# Altium project PMPi-PCB.PrjPcb
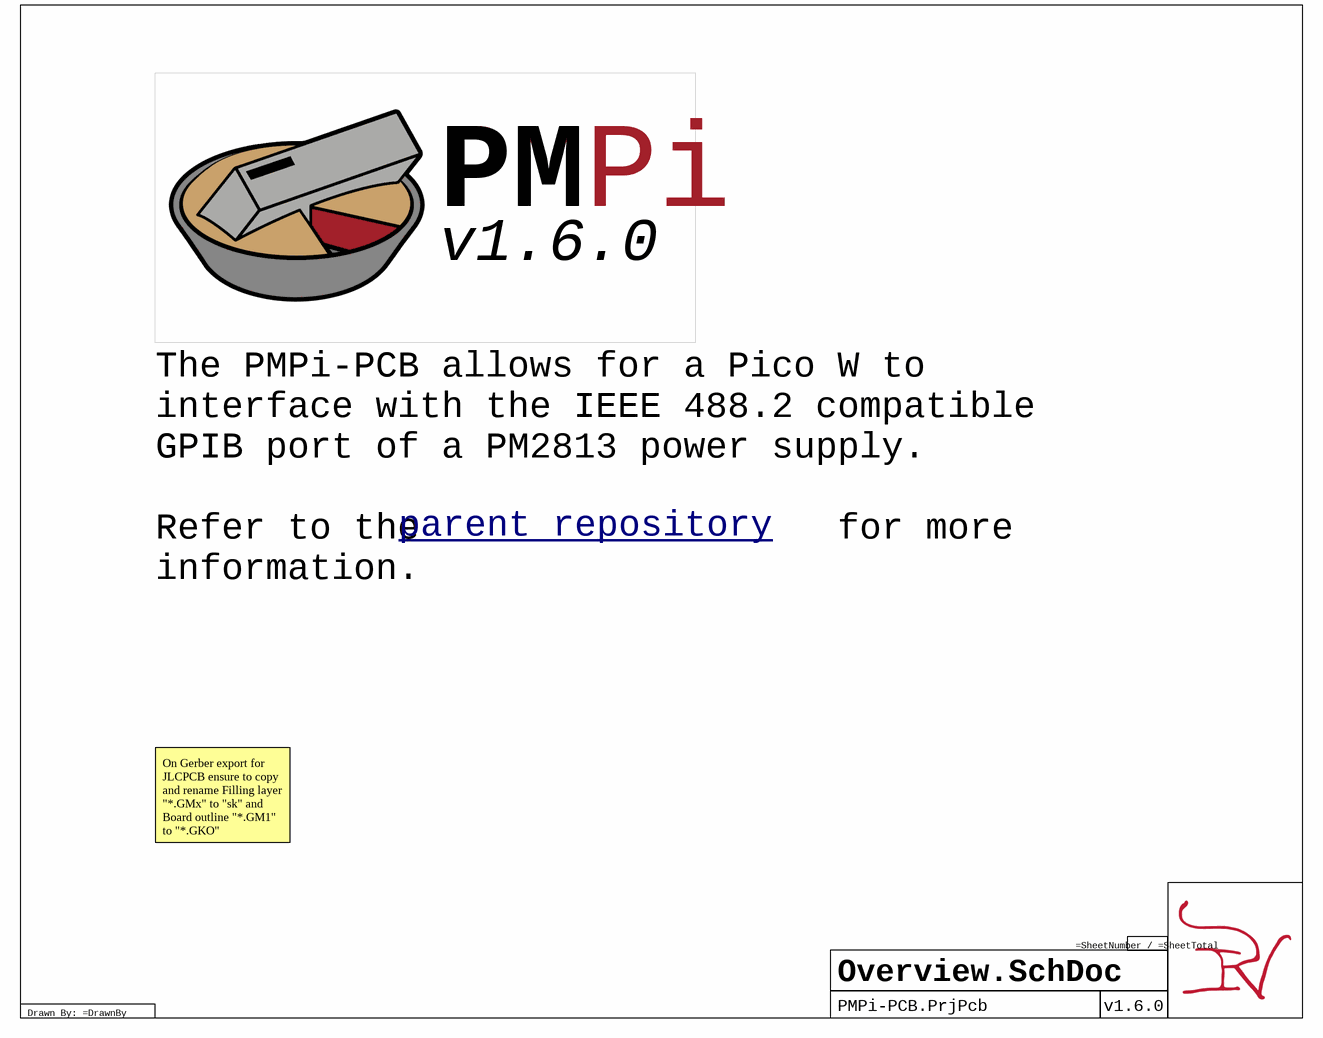
[diagram p0: Overview.SchDoc]
Version: v1.6.0; Revision: 1; Project: PMPi-PCB; LicenceYear: Copyright © 2024; Licence: Licenced under CERN-OHL-P v2; DrawnBy: IR; Author: IR
7 sheets, 31 parts. Net scope: hierarchical (ports join the sheet entries above them; power ports are global).
Board file: PMPi-PCB.PcbDoc
Sheets:
  Overview.SchDoc
    U_PMPi-PCB = PMPi-PCB.SchDoc
      U_GPIB = GPIB.SchDoc
      U_Pico = Pico.SchDoc
      U_EEPROM = Memory.SchDoc
      U_TempProbe = TempProbe.SchDoc
      U_Auth = Auth.SchDoc

## Sheet Overview.SchDoc: PMPi-PCB
size A; SheetNumber: 1; SheetTotal: 6

### Sub-sheets
U_PMPi-PCB = PMPi-PCB.SchDoc: no entries

### Notes on the sheet
- PMPi
- PM
- parent repository <https://github.com/LeHuman/PMPi>
- The PMPi-PCB allows for a Pico W to interface with the IEEE 488.2 compatible GPIB port of a PM2813 power supply.
  Refer to the                   for more information.
- On Gerber export for JLCPCB ensure to copy and rename Filling layer "*.GMx" to "sk" and Board outline "*.GM1" to "*.GKO"
- Drawn By: =DrawnBy

## Sheet PMPi-PCB.SchDoc
size A; SheetNumber: 2; SheetTotal: 7
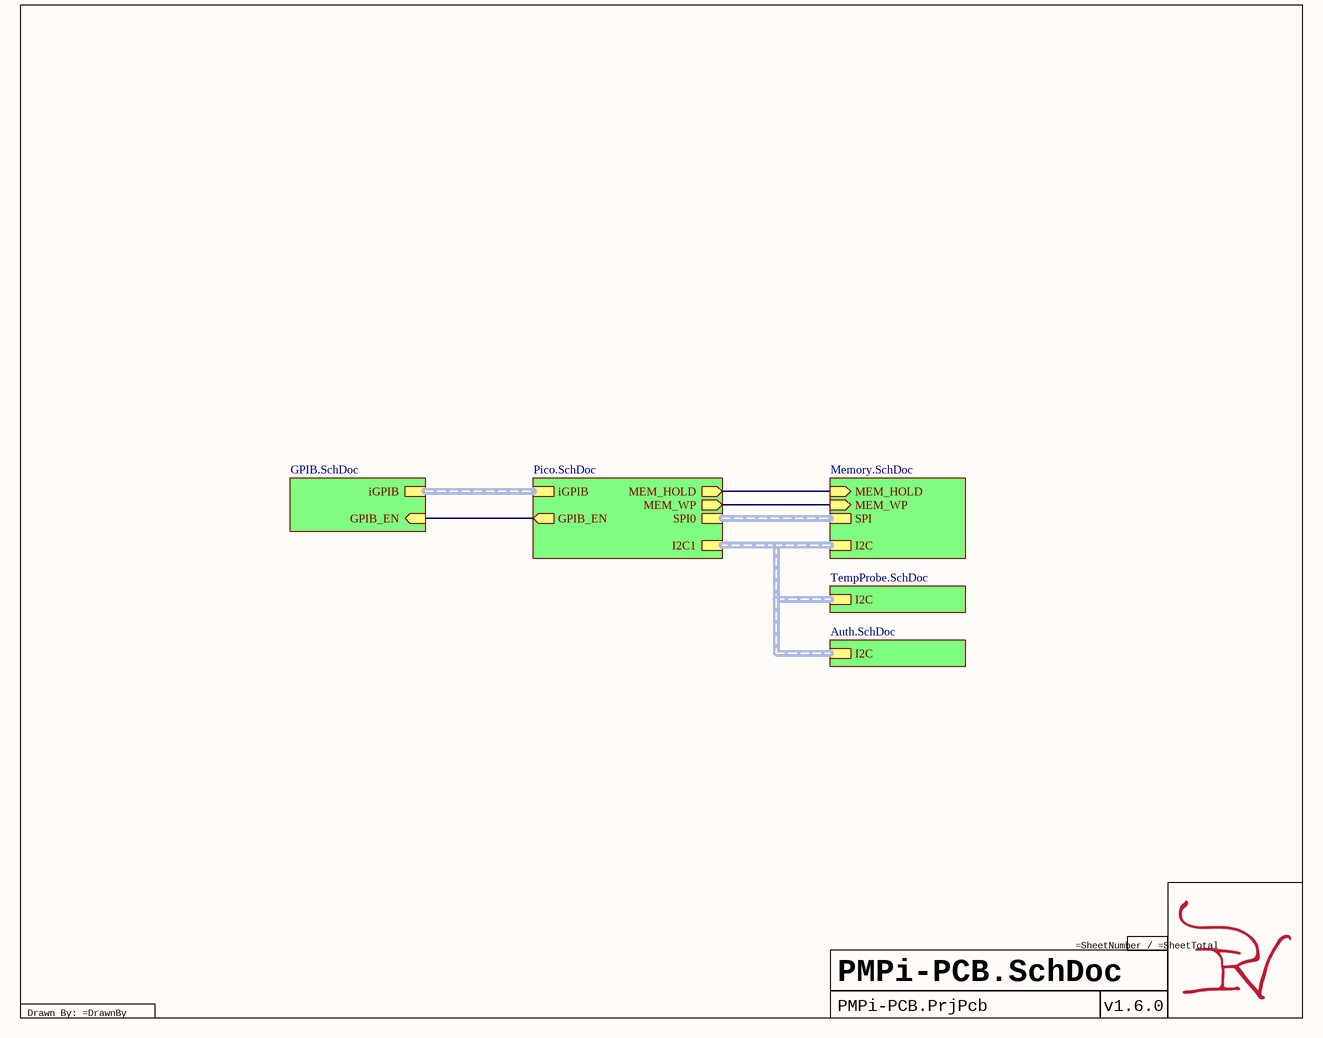
[diagram p1: PMPi-PCB.SchDoc]

### Sub-sheets
U_Auth = Auth.SchDoc: I2C (harness I2C)
U_EEPROM = Memory.SchDoc: MEM_HOLD (in), SPI (harness SPI), I2C (harness I2C), MEM_WP (in)
U_GPIB = GPIB.SchDoc: iGPIB (harness iGPIB), GPIB_EN (in)
U_Pico = Pico.SchDoc: iGPIB (harness iGPIB), SPI0 (harness SPI), MEM_HOLD (out), I2C1 (harness I2C), GPIB_EN (out), MEM_WP (out)
U_TempProbe = TempProbe.SchDoc: I2C (harness I2C)

### Nets
GPIB_EN: sheet U_GPIB/GPIB_EN, sheet U_Pico/GPIB_EN
HOLD: sheet U_Pico/MEM_HOLD, sheet U_EEPROM/MEM_HOLD
MEM_WP: sheet U_Pico/MEM_WP, sheet U_EEPROM/MEM_WP

### Buses and harness runs
harness sheet U_Auth/I2C = sheet U_EEPROM/I2C = sheet U_Pico/I2C1 = sheet U_TempProbe/I2C
harness sheet U_EEPROM/SPI = sheet U_Pico/SPI0
harness sheet U_GPIB/iGPIB = sheet U_Pico/iGPIB

### Notes on the sheet
- Drawn By: =DrawnBy

## Sheet GPIB.SchDoc
size A; SheetNumber: 3; SheetTotal: 6
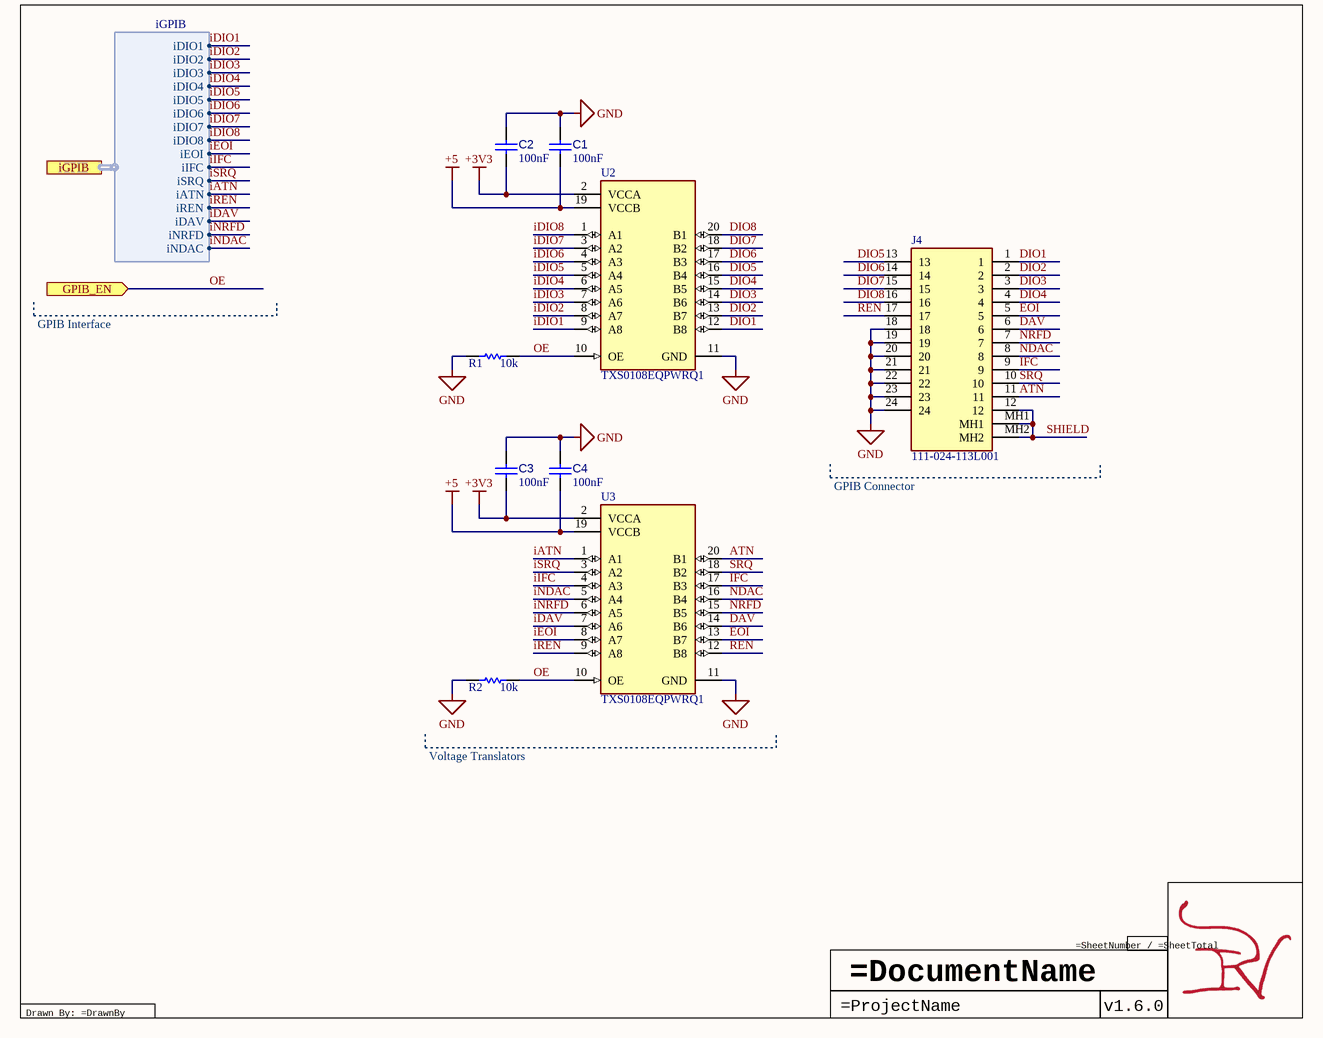
[diagram p2: GPIB.SchDoc]

### Parts
C1  value 100nF  [CAP 0402_1005]  (hidden comment: CAP-NP-2)
C2  value 100nF  [CAP 0402_1005]  (hidden comment: CAP-NP-2)
C3  value 100nF  [CAP 0402_1005]  (hidden comment: CAP-NP-2)
C4  value 100nF  [CAP 0402_1005]  (hidden comment: CAP-NP-2)
J4  111-024-113L001  [111024113L001]
R1  value 10k  [RES 0402_1005]  (hidden comment: 10K-0402-0.1/1)
R2  value 10k  [RES 0402_1005]  (hidden comment: 10K-0402-0.1/1)
U2  TXS0108EQPWRQ1  [FP-PW0020A-IPC_B]
U3  TXS0108EQPWRQ1  [FP-PW0020A-IPC_B]

### Ports
GPIB_EN (in), iGPIB (harness iGPIB)

### Harnesses
iGPIB: iEOI, iIFC, iSRQ, iATN, iREN, iDAV, iNRFD, iNDAC, iDIO8, iDIO7, iDIO6, iDIO5, iDIO4, iDIO3, iDIO2, iDIO1

### Nets
+3V3: C2.1 C3.1 U2.2(VCCA) U3.2(VCCA)
+5: C1.1 C4.1 U2.19(VCCB) U3.19(VCCB)
GND: C1.2 C2.2 C3.2 C4.2 J4.18 J4.19 J4.20 J4.21 J4.22 J4.23 J4.24 R1.1 R2.1 U2.11(GND) U3.11(GND)
ATN: J4.11 U3.20(B1)
DAV: J4.6 U3.14(B6)
DIO1: J4.1 U2.12(B8)
DIO2: J4.2 U2.13(B7)
DIO3: J4.3 U2.14(B6)
DIO4: J4.4 U2.15(B5)
DIO5: J4.13 U2.16(B4)
DIO6: J4.14 U2.17(B3)
DIO7: J4.15 U2.18(B2)
DIO8: J4.16 U2.20(B1)
EOI: J4.5 U3.13(B7)
iATN: U3.1(A1) ; port iGPIB.iATN
iDAV: U3.7(A6) ; port iGPIB.iDAV
iDIO1: U2.9(A8) ; port iGPIB.iDIO1
iDIO2: U2.8(A7) ; port iGPIB.iDIO2
iDIO3: U2.7(A6) ; port iGPIB.iDIO3
iDIO4: U2.6(A5) ; port iGPIB.iDIO4
iDIO5: U2.5(A4) ; port iGPIB.iDIO5
iDIO6: U2.4(A3) ; port iGPIB.iDIO6
iDIO7: U2.3(A2) ; port iGPIB.iDIO7
iDIO8: U2.1(A1) ; port iGPIB.iDIO8
iEOI: U3.8(A7) ; port iGPIB.iEOI
IFC: J4.9 U3.17(B3)
iIFC: U3.4(A3) ; port iGPIB.iIFC
iNDAC: U3.5(A4) ; port iGPIB.iNDAC
iNRFD: U3.6(A5) ; port iGPIB.iNRFD
iREN: U3.9(A8) ; port iGPIB.iREN
iSRQ: U3.3(A2) ; port iGPIB.iSRQ
NDAC: J4.8 U3.16(B4)
NRFD: J4.7 U3.15(B5)
OE: R1.2 R2.2 U2.10(OE) U3.10(OE) ; port GPIB_EN  [project net GPIB_EN]
REN: J4.17 U3.12(B8)
SHIELD: J4.12 J4.MH1 J4.MH2
SRQ: J4.10 U3.18(B2)

### Notes on the sheet
- GPIB Interface
- (near J4) GPIB Connector
- Voltage Translators
- Drawn By: =DrawnBy
- =DocumentName
- =ProjectName

### Library data of the parts
C1-C4 = CMP-00000-4: Ceramic Capacitor, Multilayer, Ceramic, 10V, 10% +Tol, 10% -Tol, X7R, 15% TC, 0.1uF, Surface Mount, 0402; Multilayer: Yes; Conflict Mineral: DRC Conflict Undeterminable; Global PFAS Assessment Status: Not Affected; Green: Compliant; NAS411: Affected; Rare Earth Element Information: Rare Earth Free; Capacitor Type: Ceramic; Case/Package: 0402; Dielectric Material: Ceramic; JESD-609 Code: e3; Max Operating Temperature: 125°C; Min Operating Temperature: -55°C; Mounting Technology: Surface Mount; Package Shape: Rectangular; Packaging: Tape and Reel; Pins: 2; Rated DC Voltage (URdc): 10V; Reach SVHC Compliant: Yes; RoHS Compliant: Yes; Temperature Characteristics Code: X7R; Terminal Finish: Nickel; Termination: Wraparound; Tolerance  (fill in as +-): 10%; Tolerance (fill in as +-): 10%; Tolerance: 10%; Voltage Rating: 10V; China RoHS Status: Unaffected; ELV: Compliant; EU SVHC List Version: Jan 23, 2024; Halogen Free: Compliant; Lead Free: Compliant; Persistent Organic Pollutants (POPs): Not Affected; REACH(SVHC) Information: Unaffected; RoHS Status: Yes; RoHS Version: 2011/65/EU, 2015/863; TSCA: Compliant; Capacitance: 100nF; Case Code (Imperial): 0402; Case Code (Metric): 1005; Construction: Flat; Contact Plating: Tin; Depth: 0.5mm; Dielectric: X7R; Height: 0.5mm; Length: 1mm; Mount: Surface Mount; Package Quantity: 1; Package Style: SMTMeter; Radiation Hardening: No; Series: CL; Thickness: 0.022inch; Width: 0.5mm
J4 = CMP-002-00009-2: Telecom and Datacom Connector; Manufacturer_Name: NorComp; Global PFAS Assessment Status: Not Affected; Conflict Mineral: DRC Conflict Free; Green: Unknown; TSCA: Compliant; Manufacturer_Part_Number: 111-024-113L001; Lead Free: Unknown; Persistent Organic Pollutants (POPs): Compliant; Design Item ID: 111-024-113L001; Halogen Free: Unknown; Height: 12.55mm; RoHS Status: Yes; Datasheet Link: https://componentsearchengine.com/Datasheets/2/111-024-113L001.pdf; Mouser Part Number: 636-111-024-113L001; RoHS Version: 2011/65/EU; REACH(SVHC) Information: Unaffected; EU SVHC List Version: Jan 15, 2018; ELV: Unknown; Mouser Price/Stock: https://www.mouser.co.uk/ProductDetail/NorComp/111-024-113L001?qs=IGgAdOvCTsTzuqCRtmjabw%3D%3D; Source: SamacSys.SchLib
R1 R2 = CMP-009-00033-2: Fixed Resistor, Metal Glaze/thick Film, 0.1W, 10000ohm, 50V, 1% +/-Tol, 100ppm/Cel, Surface Mount, 0402; Power: 100mW; Conflict Mineral: DRC Conflict Undeterminable; Global PFAS Assessment Status: Not Affected; Green: Not Compliant; NAS411: Affected; Package Height: 0.35mm; Package Length: 1mm; Package Width: 0.5mm; Persistent Organic Pollutants (POPs): Compliant; Rare Earth Element Information: Rare Earth Free; Rated Temperature: 70°C; Reference Standard: AEC-Q200; Temperature Coefficient: 100ppm/°C; Tolerance: 1%; Mounting Technology: Surface Mount; Min Operating Temperature: -55°C; Max Operating Temperature: 155°C; Pins: 2; RoHS Compliant: Yes; Case/Package: 0402; China RoHS Status: Affected; Construction: Rectangular; ELV: Not Compliant; EU SVHC List Version: Jan 23, 2024; Halogen Free: Compliant; JESD-609 Code: e3; Lead Free: Not Compliant; Package Shape: Rectangular; Package Style: SMTMeter; Packaging: Tape and Reel; REACH(SVHC) Information: Unaffected; Reach SVHC Compliant: Yes; Resistor Type: FIXED RESISTOR; RoHS Status: Yes with Exemption; RoHS Version: 2011/65/EU, 2015/863; Technology: METAL GLAZE/THICK FILM; Terminal Finish: Nickel; Termination: Wraparound; TSCA: Compliant; Working Voltage: 50V
U2 U3 = CMP-015-00001-1: Interface Circuit, PDSO20; Green: Compliant; Max Supply Voltage: 3.6V; Conflict Mineral: DRC Conflict Free; Min Supply Voltage: 1.4V; Rare Earth Element Information: Contain Rare Earth Element; Package Body Material: Plastic; Package Equivalence Code: TSSOP20,.25; Global PFAS Assessment Status: Not Affected; Nominal Supply Voltage: 1.5V; NAS411: Affected; Channels: 8; Reach SVHC Compliant: Yes; Package Style: SMALL OUTLINE, THIN PROFILE, SHRINK PITCHMeter; JESD-30 Code: R-PDSO-G20; Persistent Organic Pollutants (POPs): Compliant; Moisture Sensitivity Level: 1; Temperature Grade: AUTOMOTIVE; Height - Seated (Max): 1.2mm; Case/Package: TSSOP; RoHS Compliant: Yes; TSCA: Compliant; China RoHS Status: Unaffected; RoHS Version: 2011/65/EU, 2015/863; Terminal Pitch: 0.65mm; Terminal Form: Gull Wing; RoHS Status: Yes; Terminal Position: DUAL; Package Shape: Rectangular; REACH(SVHC) Information: Unaffected; Terminal Finish: Nickel; Max Operating Temperature: 125°C; Interface IC Type: INTERFACE CIRCUIT; Pins: 20; Width: 4.4mm; EU SVHC List Version: Jan 23, 2024; JESD-609 Code: e4; Halogen Free: Compliant; ELV: Compliant; Surface Mount: Yes; Min Operating Temperature: -40°C; Length: 6.5mm; Lead Free: Compliant

## Sheet Pico.SchDoc
size A; SheetNumber: 4; SheetTotal: 7
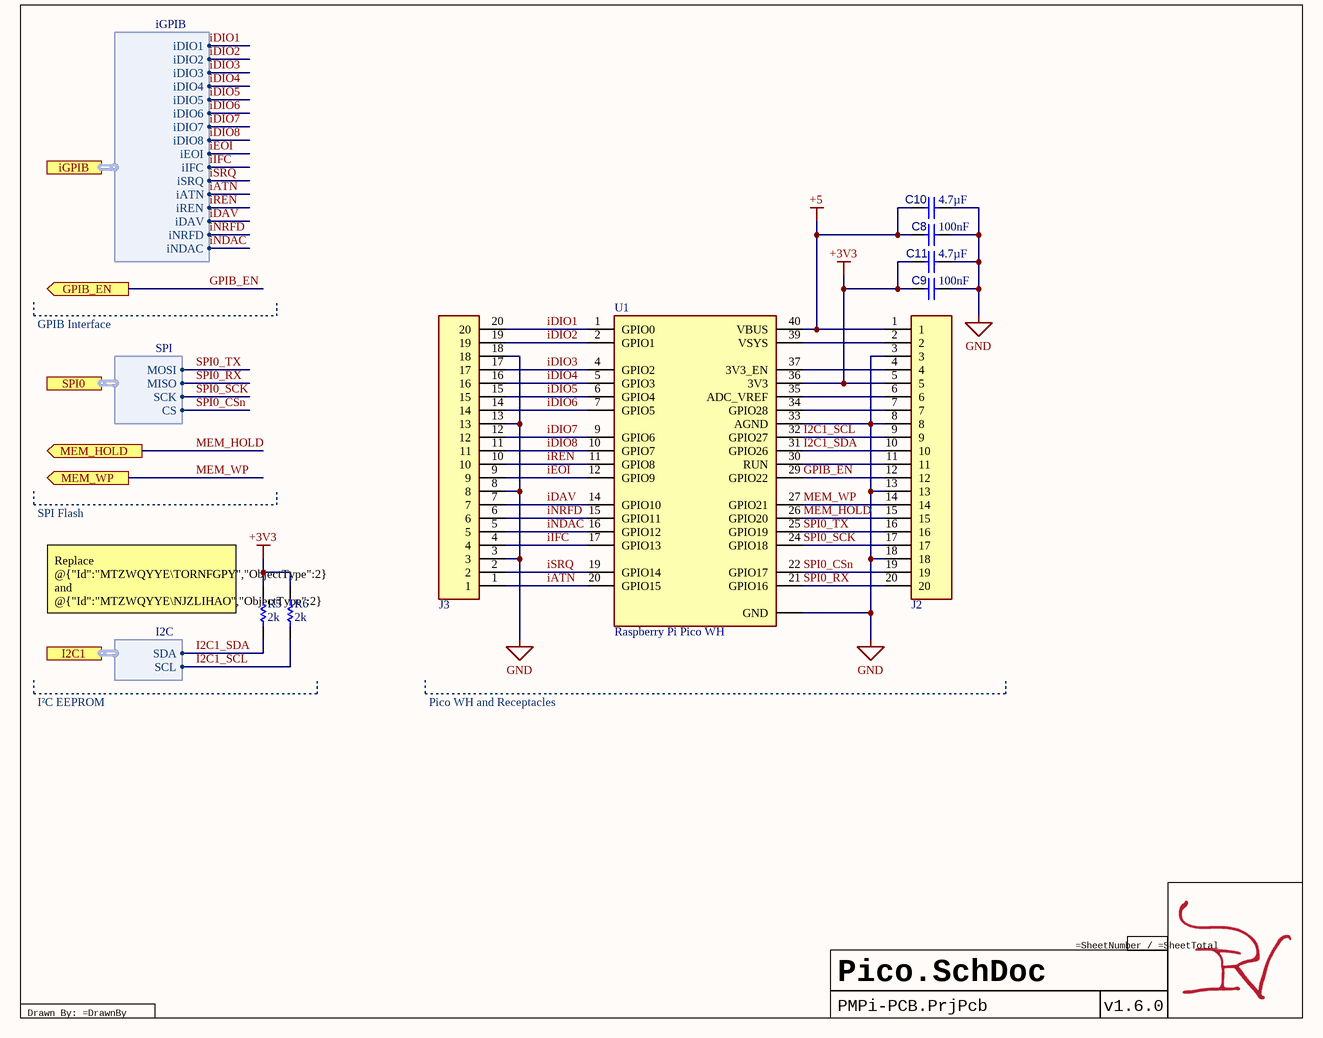
[diagram p3: Pico.SchDoc]

### Parts
C8  value 100nF  [CAP 0402_1005]  (hidden comment: CAP-NP-2)
C9  value 100nF  [CAP 0402_1005]  (hidden comment: CAP-NP-2)
C10  value 4.7µF  [CAP 0402_1005]  (hidden comment: CL05A475MP5NRNC)
C11  value 4.7µF  [CAP 0402_1005]  (hidden comment: CL05A475MP5NRNC)
J2  MDF7-20S-2.54DSA  [MDF720S254DSA55]  (value not drawn)
J3  MDF7-20S-2.54DSA  [MDF720S254DSA55]  (value not drawn)
R5  value 2k  [RES 0402_1005]  (hidden comment: 2K-0402-0.1/1)
R6  value 2k  [RES 0402_1005]  (hidden comment: 2K-0402-0.1/1)
U1  Raspberry Pi Pico WH  [RASPBERRYPIPICOWH-Footprint-1]

### Ports
GPIB_EN (out), I2C1 (harness I2C), iGPIB (harness iGPIB), MEM_HOLD (out), MEM_WP (out), SPI0 (harness SPI)

### Harnesses
iGPIB: iEOI, iIFC, iSRQ, iATN, iREN, iDAV, iNRFD, iNDAC, iDIO8, iDIO7, iDIO6, iDIO5, iDIO4, iDIO3, iDIO2, iDIO1
SPI: MOSI, MISO, SCK, CS
I2C: SDA, SCL

### Nets
+3V3: C9.2 C11.2 J2.5 R5.2 R6.2 U1.36(3V3)
+5: C8.2 C10.2 J2.1 U1.40(VBUS)
GND: C8.1 C9.1 C10.1 C11.1 J2.3 J2.8 J2.13 J2.18 J3.3 J3.8 J3.13 J3.18 U1.3,_8,_13,_18,_23,_28,_38(GND) U1.33(AGND)
GPIB_EN: J2.12 U1.29(GPIO22) ; port GPIB_EN
I2C1_SCL: J2.9 R6.1 U1.32(GPIO27) ; port I2C1.SCL
I2C1_SDA: J2.10 R5.1 U1.31(GPIO26) ; port I2C1.SDA
iATN: J3.1 U1.20(GPIO15) ; port iGPIB.iATN
iDAV: J3.7 U1.14(GPIO10) ; port iGPIB.iDAV
iDIO1: J3.20 U1.1(GPIO0) ; port iGPIB.iDIO1
iDIO2: J3.19 U1.2(GPIO1) ; port iGPIB.iDIO2
iDIO3: J3.17 U1.4(GPIO2) ; port iGPIB.iDIO3
iDIO4: J3.16 U1.5(GPIO3) ; port iGPIB.iDIO4
iDIO5: J3.15 U1.6(GPIO4) ; port iGPIB.iDIO5
iDIO6: J3.14 U1.7(GPIO5) ; port iGPIB.iDIO6
iDIO7: J3.12 U1.9(GPIO6) ; port iGPIB.iDIO7
iDIO8: J3.11 U1.10(GPIO7) ; port iGPIB.iDIO8
iEOI: J3.9 U1.12(GPIO9) ; port iGPIB.iEOI
iIFC: J3.4 U1.17(GPIO13) ; port iGPIB.iIFC
iNDAC: J3.5 U1.16(GPIO12) ; port iGPIB.iNDAC
iNRFD: J3.6 U1.15(GPIO11) ; port iGPIB.iNRFD
iREN: J3.10 U1.11(GPIO8) ; port iGPIB.iREN
iSRQ: J3.2 U1.19(GPIO14) ; port iGPIB.iSRQ
MEM_HOLD: J2.15 U1.26(GPIO20) ; port MEM_HOLD  [project net HOLD]
MEM_WP: J2.14 U1.27(GPIO21) ; port MEM_WP
SPI0_CSn: J2.19 U1.22(GPIO17) ; port SPI0.CS  [project net CS]
SPI0_RX: J2.20 U1.21(GPIO16) ; port SPI0.MISO  [project net MISO]
SPI0_SCK: J2.17 U1.24(GPIO18) ; port SPI0.SCK  [project net SCK]
SPI0_TX: J2.16 U1.25(GPIO19) ; port SPI0.MOSI  [project net MOSI]
NetJ2_2: J2.2 U1.39(VSYS)
NetJ2_4: J2.4 U1.37(3V3_EN)
NetJ2_6: J2.6 U1.35(ADC_VREF)
NetJ2_7: J2.7 U1.34(GPIO28)
NetJ2_11: J2.11 U1.30(RUN)

### Notes on the sheet
- GPIB Interface
- SPI Flash
- (near R5) Replace @{"Id":"MTZWQYYE\TORNFGPY","ObjectType":2} and @{"Id":"MTZWQYYE\NJZLIHAO","ObjectType":2} to 5K if not using Fast Mode. Low part count may also allow for 10K in any case.
- I²C EEPROM
- Pico WH and Receptacles
- Drawn By: =DrawnBy

### Library data of the parts
C8 C9 = CMP-00000-4: as C1 on sheet GPIB; Capacitor Type: Ceramic; Case/Package: 0402; Dielectric Material: Ceramic; JESD-609 Code: e3; Max Operating Temperature: 125°C; Min Operating Temperature: -55°C; Mounting Technology: Surface Mount; Package Shape: Rectangular; Packaging: Tape and Reel; Pins: 2; Rated DC Voltage (URdc): 10V; Reach SVHC Compliant: Yes; RoHS Compliant: Yes; Temperature Characteristics Code: X7R; Terminal Finish: Nickel; Termination: Wraparound; Tolerance  (fill in as +-): 10%; Tolerance (fill in as +-): 10%; Tolerance: 10%; Voltage Rating: 10V; China RoHS Status: Unaffected; ELV: Compliant; EU SVHC List Version: Jan 23, 2024; Halogen Free: Compliant; Lead Free: Compliant; Persistent Organic Pollutants (POPs): Not Affected; REACH(SVHC) Information: Unaffected; RoHS Status: Yes; RoHS Version: 2011/65/EU, 2015/863; TSCA: Compliant; Capacitance: 100nF; Case Code (Imperial): 0402; Case Code (Metric): 1005; Construction: Flat; Contact Plating: Tin; Depth: 0.5mm; Dielectric: X7R; Height: 0.5mm; Length: 1mm; Mount: Surface Mount; Package Quantity: 1; Package Style: SMTMeter; Radiation Hardening: No; Series: CL; Thickness: 0.022inch; Width: 0.5mm
C10 C11 = CMP-001-00020-1: Ceramic Capacitor, Multilayer, Ceramic, 10V, 20% +Tol, 20% -Tol, X5R, 15% TC, 4.7uF, Surface Mount, 0402; Multilayer: Yes; Terminal Finish: Nickel; JESD-609 Code: e3; Tolerance (fill in as +-): 20%; Case/Package: 0402; Max Operating Temperature: 85°C; Tolerance  (fill in as +-): 20%; Temperature Characteristics Code: X5R; Packaging: Tape and Reel; Mounting Technology: Surface Mount; Width: 0.5mm; Pins: 2; Min Operating Temperature: -55°C; Package Style: SMTMeter; Capacitor Type: Ceramic; RoHS Compliant: Yes; Height: 0.65mm; Rated DC Voltage (URdc): 10V; Termination: Wraparound; Dielectric Material: Ceramic; Reach SVHC Compliant: Yes; Package Shape: Rectangular; Length: 1mm
J2 J3 = CMP-002-00014-1: Board Connector, 20 Contact(s), 1 Row(s), Female, Straight, 0.1 inch Pitch, Solder Terminal, Locking, Black Insulator, Receptacle; Manufacturer_Name: Hirose; Manufacturer_Part_Number: MDF7-20S-2.54DSA(55); IEC Conformance: No; Number of Contacts: 20; Number of Rows Loaded: 1; Option: General Purpose; Mating Information: MULTIPLE MATING PARTS AVAILABLE; Body Breadth: 0.295inch; Body Depth: 0.197inch; Body Length: 2inch; Contact Pattern: RECTANGULAR; Contact Resistance: 30mR; Dielectric Withstanding Voltage (AC): 650V; Durability: 50Cycles; Insulation Resistance: 1GR; Rated Current (Signal): 3A; Reference Standard: UL; Reliability: COMMERCIAL; Mounting Technology: Board; Contact Finish - Mating: NOT SPECIFIED; Contact Gender: Female; Source: SamacSys.SchLib; Mounting Style: STRAIGHT; RoHS Compliant: Yes; Min Operating Temperature: -35°C; Max Operating Temperature: 85°C; Body/Shell Style: RECEPTACLE; MIL Conformance: No; Termination: Solder; Terminal Pitch: 2.54mm; DIN Conformance: No; Connector Type: BOARD CONNECTOR; Filter Feature: No; Mixed Contacts: No; Design Item ID: MDF7-20S-2.54DSA_55_; Datasheet Link: https://datasheet.datasheetarchive.com/originals/distributors/SFDatasheet-7/sf-000141364.pdf; Flammability Rating: UL94 V-0; Height: 5.3mm; Insulation Color: Black; Insulation Material: Polyamide; Mating Contact Pitch: 0.1inch; Mounting Option 1: LOCKING; Mouser Part Number: 798-MDF720S254DSA55; Mouser Price/Stock: https://www.mouser.co.uk/ProductDetail/Hirose-Connector/MDF7-20S-254DSA55?qs=zOgoZG1CgI9V9vKe%252BtgddQ%3D%3D; Number Of Connectors: 1; Terminal Length: 0.118inch
R5 R6 = CMP-009-00034-1: Fixed Resistor, Metal Glaze/thick Film, 0.1W, 2000ohm, 50V, 1% +/-Tol, 100ppm/Cel, Surface Mount, 0402; TSCA: Compliant; Conflict Mineral: DRC Conflict Undeterminable; Package Width: 0.5mm; Rated Temperature: 70°C; Reference Standard: AEC-Q200; Rare Earth Element Information: Rare Earth Free; Package Length: 1mm; Green: Not Compliant; Global PFAS Assessment Status: Not Affected; Package Height: 0.35mm; Temperature Coefficient: 100ppm/°C; Power: 100mW; NAS411: Affected; Lead Free: Not Compliant; Tolerance: 1%; Min Operating Temperature: -55°C; REACH(SVHC) Information: Unaffected; Resistor Type: FIXED RESISTOR; RoHS Compliant: Yes; China RoHS Status: Affected; Reach SVHC Compliant: Yes; Persistent Organic Pollutants (POPs): Compliant; Mounting Technology: Surface Mount; Package Style: SMTMeter; Halogen Free: Compliant; Technology: METAL GLAZE/THICK FILM; Package Shape: Rectangular; EU SVHC List Version: Jan 23, 2024; Working Voltage: 50V; Termination: Wraparound; Pins: 2; Max Operating Temperature: 155°C; Terminal Finish: Nickel; RoHS Status: Yes with Exemption; RoHS Version: 2011/65/EU, 2015/863; Construction: Rectangular; ELV: Not Compliant; Case/Package: 0402; JESD-609 Code: e3; Packaging: Tape and Reel
U1 = CMP-759-000000-4: RASPBERRY PI BOARD, ARM CORTEX-M0+; Silicon Manufacturer: Raspberry Pi; No. of Bits: 32bit; Silicon Family Name: -;...; pin to pad: 3,8,13,18,23,28,38>3+8+13+18+23+28+38; ComponentLink1URL: https://github.com/recursivenomad/ki-lime-pi-pico; ComponentLink1Description: Source; Design Item ID: CMP-00016-14; Source: Main.SCHLIB

## Sheet Memory.SchDoc
size A; SheetNumber: 5; SheetTotal: 7
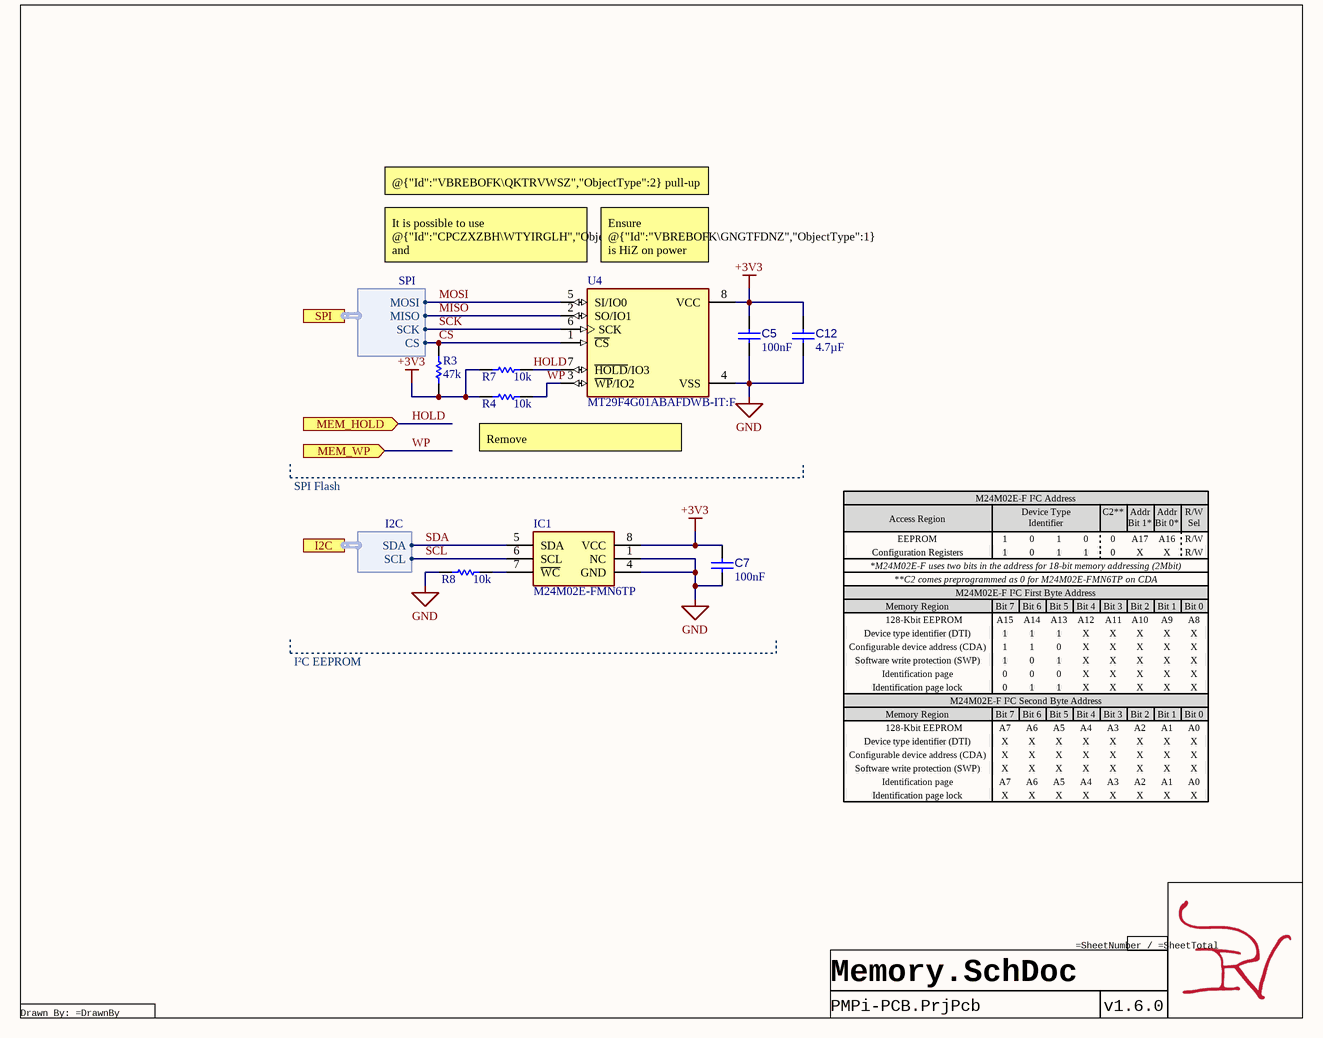
[diagram p4: Memory.SchDoc]

### Parts
C5  value 100nF  [CAP 0402_1005]  (hidden comment: CAP-NP-2)
C7  value 100nF  [CAP 0402_1005]  (hidden comment: CAP-NP-2)
C12  value 4.7µF  [CAP 0402_1005]  (hidden comment: CL05A475MP5NRNC)
IC1  M24M02E-FMN6TP  [SOIC127P600X175-8N]
R3  value 47k  [RES 0402_1005]  (hidden comment: 47k-0402-0.1/1)
R4  value 10k  [RES 0402_1005]  (hidden comment: 10K-0402-0.1/1)
R7  value 10k  [RES 0402_1005]  (hidden comment: 10K-0402-0.1/1)
R8  value 10k  [RES 0402_1005]  (hidden comment: 10K-0402-0.1/1)
U4  MT29F4G01ABAFDWB-IT:F  [FP-WB-IPC_B]

### Ports
I2C (harness I2C), MEM_HOLD (in), MEM_WP (in), SPI (harness SPI)

### Harnesses
SPI: MOSI, MISO, SCK, CS
I2C: SDA, SCL

### Nets
+3V3: C5.2 C7.2 C12.2 IC1.8(VCC) R3.1 R4.1 R7.1 U4.8(VCC)
GND: C5.1 C7.1 C12.1 IC1.1(NC) IC1.4(GND) R8.1 U4.4(VSS)
CS: R3.2 U4.1(~{CS}) ; port SPI.CS
HOLD: R7.2 U4.7(~{HOLD}/IO3) ; port MEM_HOLD
MISO: U4.2(SO/IO1) ; port SPI.MISO
MOSI: U4.5(SI/IO0) ; port SPI.MOSI
SCK: U4.6(SCK) ; port SPI.SCK
SCL: IC1.6(SCL) ; port I2C.SCL  [project net I2C1_SCL]
SDA: IC1.5(SDA) ; port I2C.SDA  [project net I2C1_SDA]
WP: R4.2 U4.3(~{WP}/IO2) ; port MEM_WP  [project net MEM_WP]
NetIC1_7: IC1.7(~{WC}) R8.2

### Notes on the sheet
- @{"Id":"VBREBOFK\QKTRVWSZ","ObjectType":2} pull-up can be replaced with a 10k if desired (not tested)
- (near U4) It is possible to use @{"Id":"CPCZXZBH\WTYIRGLH","ObjectType":1} and @{"Id":"CPCZXZBH\EESAOWRM","ObjectType":1} and I/O lines if the Pico uses it's PIO's to make a QSPI line
- (near U4) Ensure @{"Id":"VBREBOFK\GNGTFDNZ","ObjectType":1} is HiZ on power off / brownout
- SPI Flash
- Remove @{"Id":"VBREBOFK\CTDEZDKE","ObjectType":2} and @{"Id":"VBREBOFK\WKPZANBB","ObjectType":2} if using QSPI
- M24M02E-F I²C Address
- Access Region
- EEPROM
- Configuration Registers
- *M24M02E-F uses two bits in the address for 18-bit memory addressing (2Mbit)
- Device Type
  Identifier
- 1
- 0
- C2**
- A17
- X
- Addr Bit 1*
- A16
- Addr Bit 0*
- R/W
  Sel
- R/W
- Memory Region
- M24M02E-F I²C First Byte Address
- Device type identifier (DTI)
- **C2 comes preprogrammed as 0 for M24M02E-FMN6TP on CDA
- 128-Kbit EEPROM
- Bit 7
- A15
- Bit 6
- A14
- Bit 5
- A13
- Bit 4
- A12
- Bit 3
- A11
- Bit 2
- A10
- Bit 1
- A9
- Bit 0
- A8
- I²C EEPROM
- Configurable device address (CDA)
- Software write protection (SWP)
- Identification page
- Identification page lock
- M24M02E-F I²C Second Byte Address
- A7
- A6
- A5
- A4
- A3
- A2
- A1
- A0
- Drawn By: =DrawnBy

### Library data of the parts
C5 C7 = CMP-00000-4: as C1 on sheet GPIB; Capacitor Type: Ceramic; Case/Package: 0402; Dielectric Material: Ceramic; JESD-609 Code: e3; Max Operating Temperature: 125°C; Min Operating Temperature: -55°C; Mounting Technology: Surface Mount; Package Shape: Rectangular; Packaging: Tape and Reel; Pins: 2; Rated DC Voltage (URdc): 10V; Reach SVHC Compliant: Yes; RoHS Compliant: Yes; Temperature Characteristics Code: X7R; Terminal Finish: Nickel; Termination: Wraparound; Tolerance  (fill in as +-): 10%; Tolerance (fill in as +-): 10%; Tolerance: 10%; Voltage Rating: 10V; China RoHS Status: Unaffected; ELV: Compliant; EU SVHC List Version: Jan 23, 2024; Halogen Free: Compliant; Lead Free: Compliant; Persistent Organic Pollutants (POPs): Not Affected; REACH(SVHC) Information: Unaffected; RoHS Status: Yes; RoHS Version: 2011/65/EU, 2015/863; TSCA: Compliant; Capacitance: 100nF; Case Code (Imperial): 0402; Case Code (Metric): 1005; Construction: Flat; Contact Plating: Tin; Depth: 0.5mm; Dielectric: X7R; Height: 0.5mm; Length: 1mm; Mount: Surface Mount; Package Quantity: 1; Package Style: SMTMeter; Radiation Hardening: No; Series: CL; Thickness: 0.022inch; Width: 0.5mm
C12 = CMP-001-00020-1: as C10 on sheet Pico; Terminal Finish: Nickel; JESD-609 Code: e3; Tolerance (fill in as +-): 20%; Case/Package: 0402; Max Operating Temperature: 85°C; Tolerance  (fill in as +-): 20%; Temperature Characteristics Code: X5R; Packaging: Tape and Reel; Mounting Technology: Surface Mount; Width: 0.5mm; Pins: 2; Min Operating Temperature: -55°C; Package Style: SMTMeter; Capacitor Type: Ceramic; RoHS Compliant: Yes; Height: 0.65mm; Rated DC Voltage (URdc): 10V; Termination: Wraparound; Dielectric Material: Ceramic; Reach SVHC Compliant: Yes; Package Shape: Rectangular; Length: 1mm
IC1 = CMP-031-00004-5: 2 Mbit Serial I2C bus EEPROM with configurable device address and software write protection registers; pin to pad: 1>1+2+3; Manufacturer_Name: STMicroelectronics; Mouser Price/Stock: https://www.mouser.co.uk/ProductDetail/STMicroelectronics/M24M02E-FMN6TP?qs=HoCaDK9Nz5fTB3MAjTQXBw%3D%3D; Mouser Part Number: 511-M24M02E-FMN6TP; Design Item ID: M24M02E-FMN6TP; Source: SamacSys.SchLib; Datasheet Link: https://www.st.com/resource/en/datasheet/m24m02e-f.pdf; Height: 1.75mm; Manufacturer_Part_Number: M24M02E-FMN6TP
R3 = CMP-009-00042-1: Fixed Resistor, Metal Glaze/thick Film, 0.1W, 47000ohm, 50V, 1% +/-Tol, 100ppm/Cel, Surface Mount, 0402; Package Width: 0.5mm; Package Length: 1mm; Rated Temperature: 70°C; Power: 100mW; Reference Standard: AEC-Q200; Package Height: 0.35mm; Temperature Coefficient: 100ppm/°C; Tolerance: 1%; Package Shape: Rectangular; Package Style: SMTMeter; Mounting Technology: Surface Mount; JESD-609 Code: e3; Terminal Finish: Nickel; Case/Package: 0402; Packaging: Tape and Reel; Pins: 2; Construction: Rectangular; Termination: Wraparound; RoHS Compliant: Yes; Technology: METAL GLAZE/THICK FILM; Resistor Type: FIXED RESISTOR; Working Voltage: 50V; Max Operating Temperature: 155°C; Reach SVHC Compliant: Yes; Min Operating Temperature: -55°C
R4 R7 R8 = CMP-009-00033-2: as R1 on sheet GPIB; Tolerance: 1%; Mounting Technology: Surface Mount; Min Operating Temperature: -55°C; Max Operating Temperature: 155°C; Pins: 2; RoHS Compliant: Yes; Case/Package: 0402; China RoHS Status: Affected; Construction: Rectangular; ELV: Not Compliant; EU SVHC List Version: Jan 23, 2024; Halogen Free: Compliant; JESD-609 Code: e3; Lead Free: Not Compliant; Package Shape: Rectangular; Package Style: SMTMeter; Packaging: Tape and Reel; REACH(SVHC) Information: Unaffected; Reach SVHC Compliant: Yes; Resistor Type: FIXED RESISTOR; RoHS Status: Yes with Exemption; RoHS Version: 2011/65/EU, 2015/863; Technology: METAL GLAZE/THICK FILM; Terminal Finish: Nickel; Termination: Wraparound; TSCA: Compliant; Working Voltage: 50V
U4 = CMP-019-00004-2: SLC NAND Flash Serial-SPI 3.3V 4Gbit 4G X 1bit 5ns/6ns 8-Pin UPDFN Tray

## Sheet TempProbe.SchDoc
size A; SheetNumber: 6; SheetTotal: 7
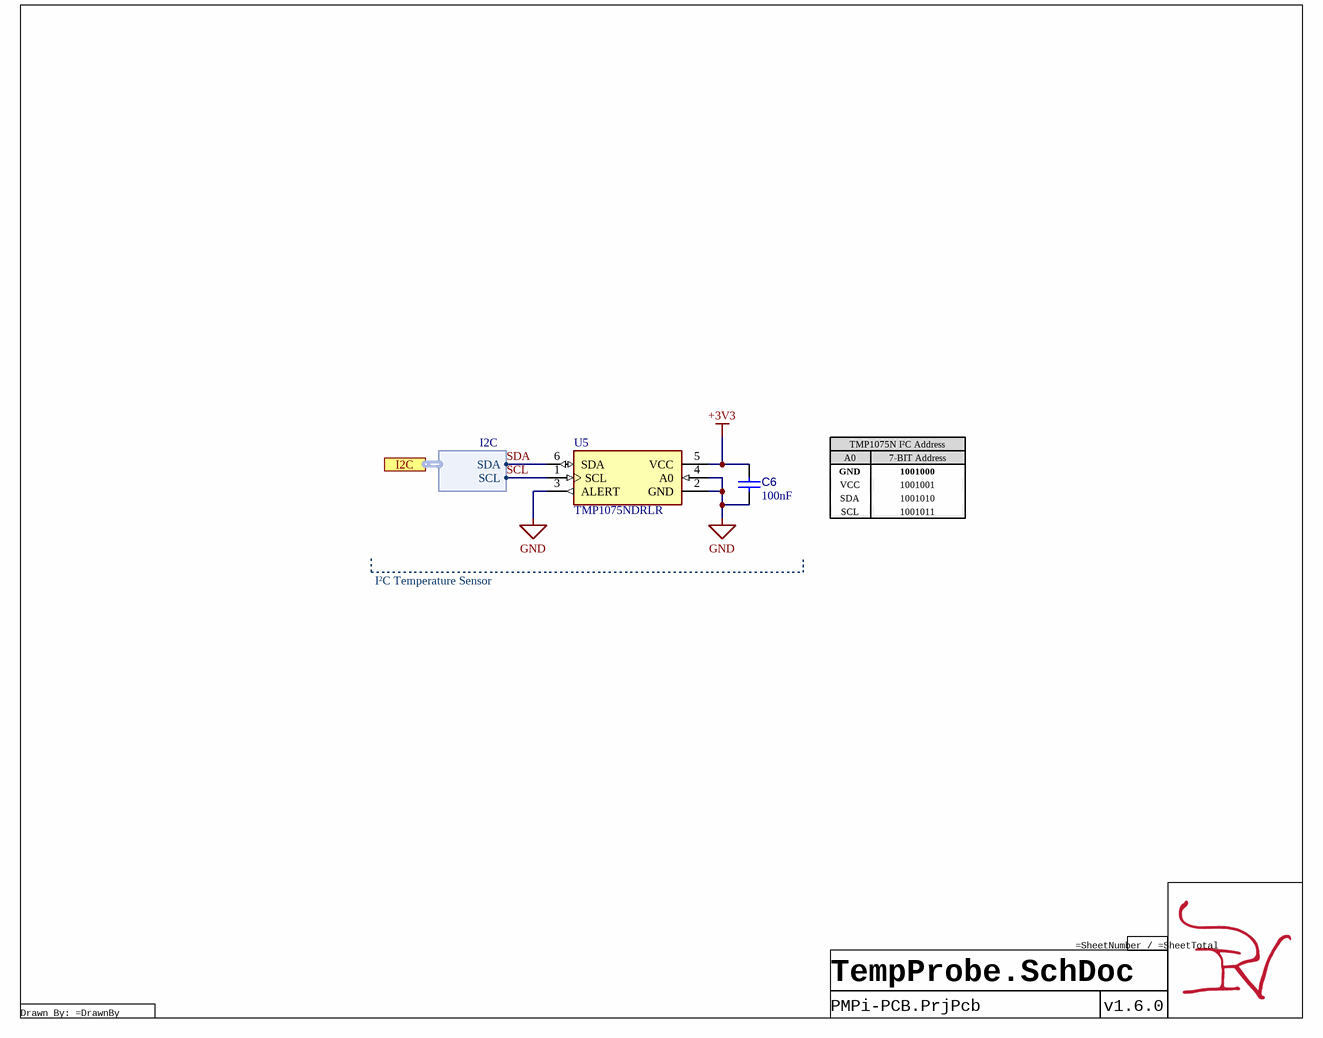
[diagram p5: TempProbe.SchDoc]

### Parts
C6  value 100nF  [CAP 0402_1005]  (hidden comment: CAP-NP-2)
U5  TMP1075NDRLR  [SOT50P160X60-6N]

### Ports
I2C (harness I2C)

### Harnesses
I2C: SDA, SCL

### Nets
+3V3: C6.2 U5.5(VCC)
GND: C6.1 U5.2(GND) U5.3(ALERT) U5.4(A0)
SCL: U5.1(SCL) ; port I2C.SCL  [project net I2C1_SCL]
SDA: U5.6(SDA) ; port I2C.SDA  [project net I2C1_SDA]

### Notes on the sheet
- A0
- GND
- VCC
- SDA
- TMP1075N I²C Address
- 7-BIT Address
- 1001000
- 1001001
- 1001010
- SCL
- 1001011
- I²C Temperature Sensor
- Drawn By: =DrawnBy

### Library data of the parts
C6 = CMP-00000-4: as C1 on sheet GPIB; Capacitor Type: Ceramic; Case/Package: 0402; Dielectric Material: Ceramic; JESD-609 Code: e3; Max Operating Temperature: 125°C; Min Operating Temperature: -55°C; Mounting Technology: Surface Mount; Package Shape: Rectangular; Packaging: Tape and Reel; Pins: 2; Rated DC Voltage (URdc): 10V; Reach SVHC Compliant: Yes; RoHS Compliant: Yes; Temperature Characteristics Code: X7R; Terminal Finish: Nickel; Termination: Wraparound; Tolerance  (fill in as +-): 10%; Tolerance (fill in as +-): 10%; Tolerance: 10%; Voltage Rating: 10V; China RoHS Status: Unaffected; ELV: Compliant; EU SVHC List Version: Jan 23, 2024; Halogen Free: Compliant; Lead Free: Compliant; Persistent Organic Pollutants (POPs): Not Affected; REACH(SVHC) Information: Unaffected; RoHS Status: Yes; RoHS Version: 2011/65/EU, 2015/863; TSCA: Compliant; Capacitance: 100nF; Case Code (Imperial): 0402; Case Code (Metric): 1005; Construction: Flat; Contact Plating: Tin; Depth: 0.5mm; Dielectric: X7R; Height: 0.5mm; Length: 1mm; Mount: Surface Mount; Package Quantity: 1; Package Style: SMTMeter; Radiation Hardening: No; Series: CL; Thickness: 0.022inch; Width: 0.5mm
U5 = CMP-773-000000-3: Serial Switch/Digital Sensor, 12 Bit(s), 2Cel, Rectangular, 6 Pin, Surface Mount; MF: {'manufacturer': u'Texas Instruments'}; Value: *; Design Item ID: TMP1075NDRLR; MP: TMP1075NDRLR; Price: None; Package: None; Source: TMP1075NDRLR.SchLib; Availability: Unavailable; RoHS Compliant: Yes

## Sheet Auth.SchDoc
size A; SheetNumber: 7; SheetTotal: 7
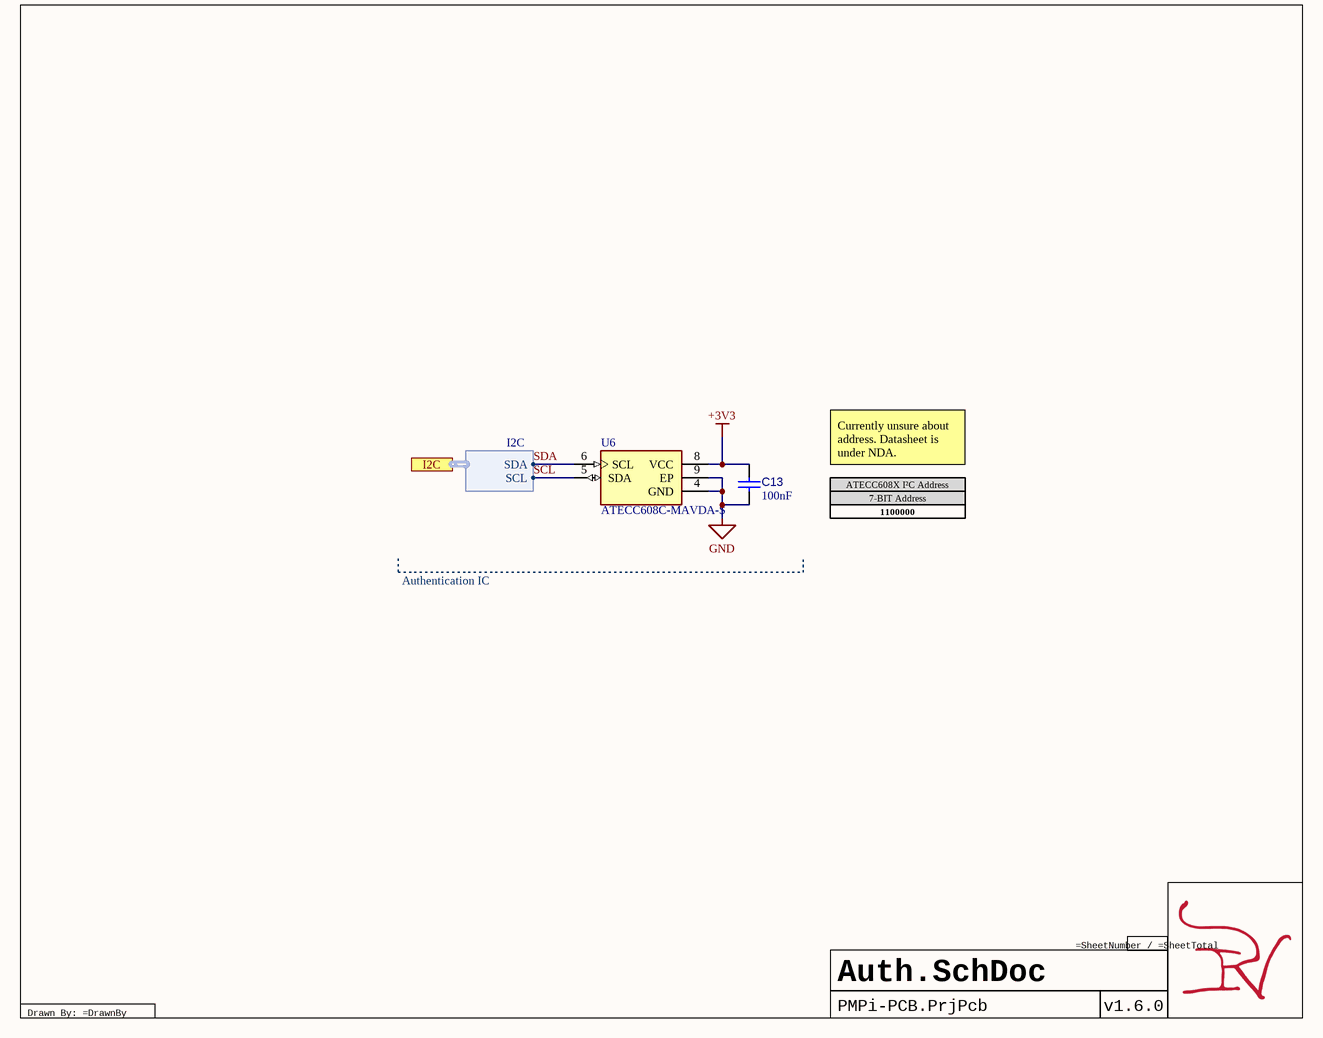
[diagram p6: Auth.SchDoc]

### Parts
C13  value 100nF  [CAP 0402_1005]  (hidden comment: CAP-NP-2)
U6  ATECC608C-MAVDA-S  [FP-C04-21355-Q4B-MFG]

### Ports
I2C (harness I2C)

### Harnesses
I2C: SDA, SCL

### Nets
+3V3: C13.1 U6.8(VCC)
GND: C13.2 U6.4(GND) U6.9(EP)
SCL: U6.5(SDA) ; port I2C.SCL  [project net I2C1_SCL]
SDA: U6.6(SCL) ; port I2C.SDA  [project net I2C1_SDA]

### Notes on the sheet
- 7-BIT Address
- ATECC608X I²C Address
- Currently unsure about address. Datasheet is under NDA.
- 1100000
- Authentication IC
- Drawn By: =DrawnBy

### Library data of the parts
C13 = CMP-00000-4: as C1 on sheet GPIB; Capacitor Type: Ceramic; Case/Package: 0402; Dielectric Material: Ceramic; JESD-609 Code: e3; Max Operating Temperature: 125°C; Min Operating Temperature: -55°C; Mounting Technology: Surface Mount; Package Shape: Rectangular; Packaging: Tape and Reel; Pins: 2; Rated DC Voltage (URdc): 10V; Reach SVHC Compliant: Yes; RoHS Compliant: Yes; Temperature Characteristics Code: X7R; Terminal Finish: Nickel; Termination: Wraparound; Tolerance  (fill in as +-): 10%; Tolerance (fill in as +-): 10%; Tolerance: 10%; Voltage Rating: 10V; China RoHS Status: Unaffected; ELV: Compliant; EU SVHC List Version: Jan 23, 2024; Halogen Free: Compliant; Lead Free: Compliant; Persistent Organic Pollutants (POPs): Not Affected; REACH(SVHC) Information: Unaffected; RoHS Status: Yes; RoHS Version: 2011/65/EU, 2015/863; TSCA: Compliant; Capacitance: 100nF; Case Code (Imperial): 0402; Case Code (Metric): 1005; Construction: Flat; Contact Plating: Tin; Depth: 0.5mm; Dielectric: X7R; Height: 0.5mm; Length: 1mm; Mount: Surface Mount; Package Quantity: 1; Package Style: SMTMeter; Radiation Hardening: No; Series: CL; Thickness: 0.022inch; Width: 0.5mm
U6 = CMP-031-00009-5: ECC/ECDH, 100C, I2C, small 3K reel UDFN; RoHS Compliant: Yes

## Nets that join several sheets
+3V3: GPIB (C2.1 C3.1 U2.2 U3.2), Pico (6 pins), Memory (8 pins), TempProbe (C6.2 U5.5), Auth (C13.1 U6.8)
+5: GPIB (C1.1 C4.1 U2.19 U3.19), Pico (C8.2 C10.2 J2.1 U1.40)
GND: GPIB (15 pins), Pico (14 pins), Memory (7 pins), TempProbe (C6.1 U5.2 U5.3 U5.4), Auth (C13.2 U6.4 U6.9)
CS: Pico (J2.19 U1.22), Memory (R3.2 U4.1)
GPIB_EN: GPIB (R1.2 R2.2 U2.10 U3.10), Pico (J2.12 U1.29)
HOLD: Pico (J2.15 U1.26), Memory (R7.2 U4.7)
I2C1_SCL: Pico (J2.9 R6.1 U1.32), Memory (IC1.6), TempProbe (U5.1), Auth (U6.5)
I2C1_SDA: Pico (J2.10 R5.1 U1.31), Memory (IC1.5), TempProbe (U5.6), Auth (U6.6)
iATN: GPIB (U3.1), Pico (J3.1 U1.20)
iDAV: GPIB (U3.7), Pico (J3.7 U1.14)
iDIO1: GPIB (U2.9), Pico (J3.20 U1.1)
iDIO2: GPIB (U2.8), Pico (J3.19 U1.2)
iDIO3: GPIB (U2.7), Pico (J3.17 U1.4)
iDIO4: GPIB (U2.6), Pico (J3.16 U1.5)
iDIO5: GPIB (U2.5), Pico (J3.15 U1.6)
iDIO6: GPIB (U2.4), Pico (J3.14 U1.7)
iDIO7: GPIB (U2.3), Pico (J3.12 U1.9)
iDIO8: GPIB (U2.1), Pico (J3.11 U1.10)
iEOI: GPIB (U3.8), Pico (J3.9 U1.12)
iIFC: GPIB (U3.4), Pico (J3.4 U1.17)
iNDAC: GPIB (U3.5), Pico (J3.5 U1.16)
iNRFD: GPIB (U3.6), Pico (J3.6 U1.15)
iREN: GPIB (U3.9), Pico (J3.10 U1.11)
iSRQ: GPIB (U3.3), Pico (J3.2 U1.19)
MEM_WP: Pico (J2.14 U1.27), Memory (R4.2 U4.3)
MISO: Pico (J2.20 U1.21), Memory (U4.2)
MOSI: Pico (J2.16 U1.25), Memory (U4.5)
SCK: Pico (J2.17 U1.24), Memory (U4.6)